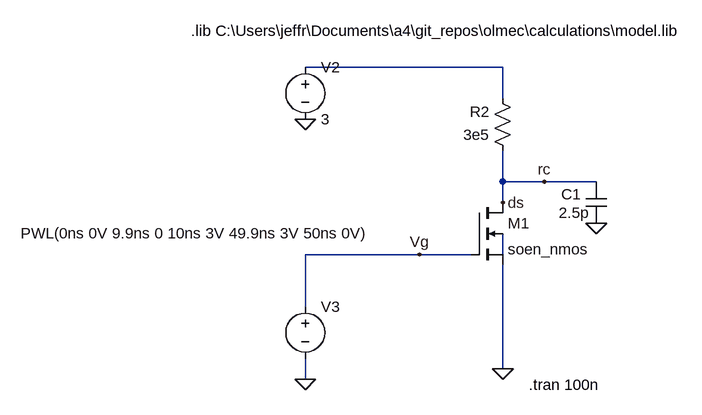
[diagram p0: schematic mosfet__rc__t_on.asc]
mosfet__rc__t_on.asc, the LTspice schematic file:
Version 4
SHEET 1 880 680
WIRE -272 16 -576 16
WIRE -272 64 -272 16
WIRE -272 192 -272 144
WIRE -208 192 -272 192
WIRE -128 192 -208 192
WIRE -272 224 -272 192
WIRE -400 304 -576 304
WIRE -320 304 -400 304
WIRE -272 304 -272 272
WIRE -576 384 -576 304
WIRE -272 480 -272 320
WIRE -576 496 -576 464
FLAG -576 96 0
FLAG -576 496 0
FLAG -272 224 ds
FLAG -400 304 Vg
FLAG -272 480 0
FLAG -208 192 rc
FLAG -128 256 0
SYMBOL voltage -576 0 R0
WINDOW 123 0 0 Left 0
WINDOW 39 0 0 Left 0
SYMATTR InstName V2
SYMATTR Value 3
SYMBOL voltage -576 368 R0
WINDOW 123 0 0 Left 0
WINDOW 39 0 0 Left 0
WINDOW 3 -438 -97 Left 2
SYMATTR Value PWL(0ns 0V 9.9ns 0 10ns 3V 49.9ns 3V 50ns 0V)
SYMATTR InstName V3
SYMBOL nmos4 -320 224 R0
SYMATTR InstName M1
SYMATTR Value soen_nmos
SYMATTR Value2 l=1u w=10u
SYMBOL cap -144 192 R0
WINDOW 0 -38 19 Left 2
WINDOW 3 -42 48 Left 2
SYMATTR InstName C1
SYMATTR Value 2.5p
SYMBOL res -256 160 R180
WINDOW 0 36 76 Left 2
WINDOW 3 36 40 Left 2
SYMATTR InstName R2
SYMATTR Value 3e5
TEXT -232 504 Left 2 !.tran 100n
TEXT -752 -40 Left 2 !.lib C:\\Users\\jeffr\\Documents\\a4\\git_repos\\olmec\\calculations\\model.lib

The netlist it stands for:
* mosfet__rc__t_on.asc
V2 N001 0 3
V3 Vg 0 PWL(0ns 0V 9.9ns 0 10ns 3V 49.9ns 3V 50ns 0V)
M1 rc Vg 0 N002 soen_nmos l=1u w=10u
C1 rc 0 2.5p
R2 rc N001 3e5
.model NMOS NMOS
.model PMOS PMOS
.lib standard.mos
.tran 100n
.lib C:\Users\jeffr\Documents\a4\git_repos\olmec\calculations\model.lib
.backanno
.end

* Results of the author's LTspice run, read from the files saved beside the schematic
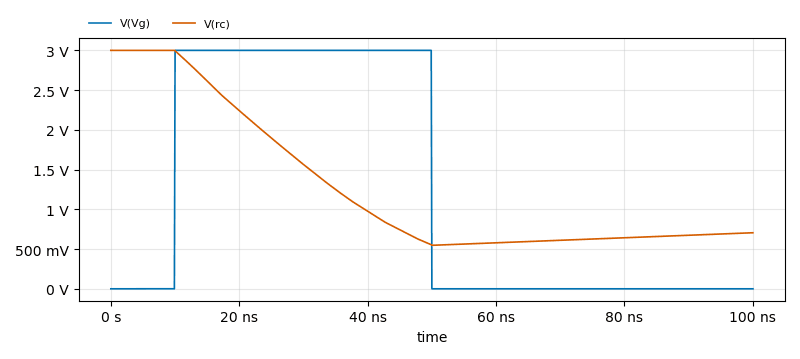
[diagram p1: Transient Analysis of mosfet__rc__t_on.asc, plotted from the saved traces]
* Transient Analysis, 1 run:
*   V(Vg): min 0 V, max 3 V, average 1.2 V, rms 1.897 V, last 0 V
*   V(rc): min 547.1 mV, max 3 V, average 1.265 V, rms 1.541 V, last 705.3 mV